# Altium project MASTER.PrjPcb
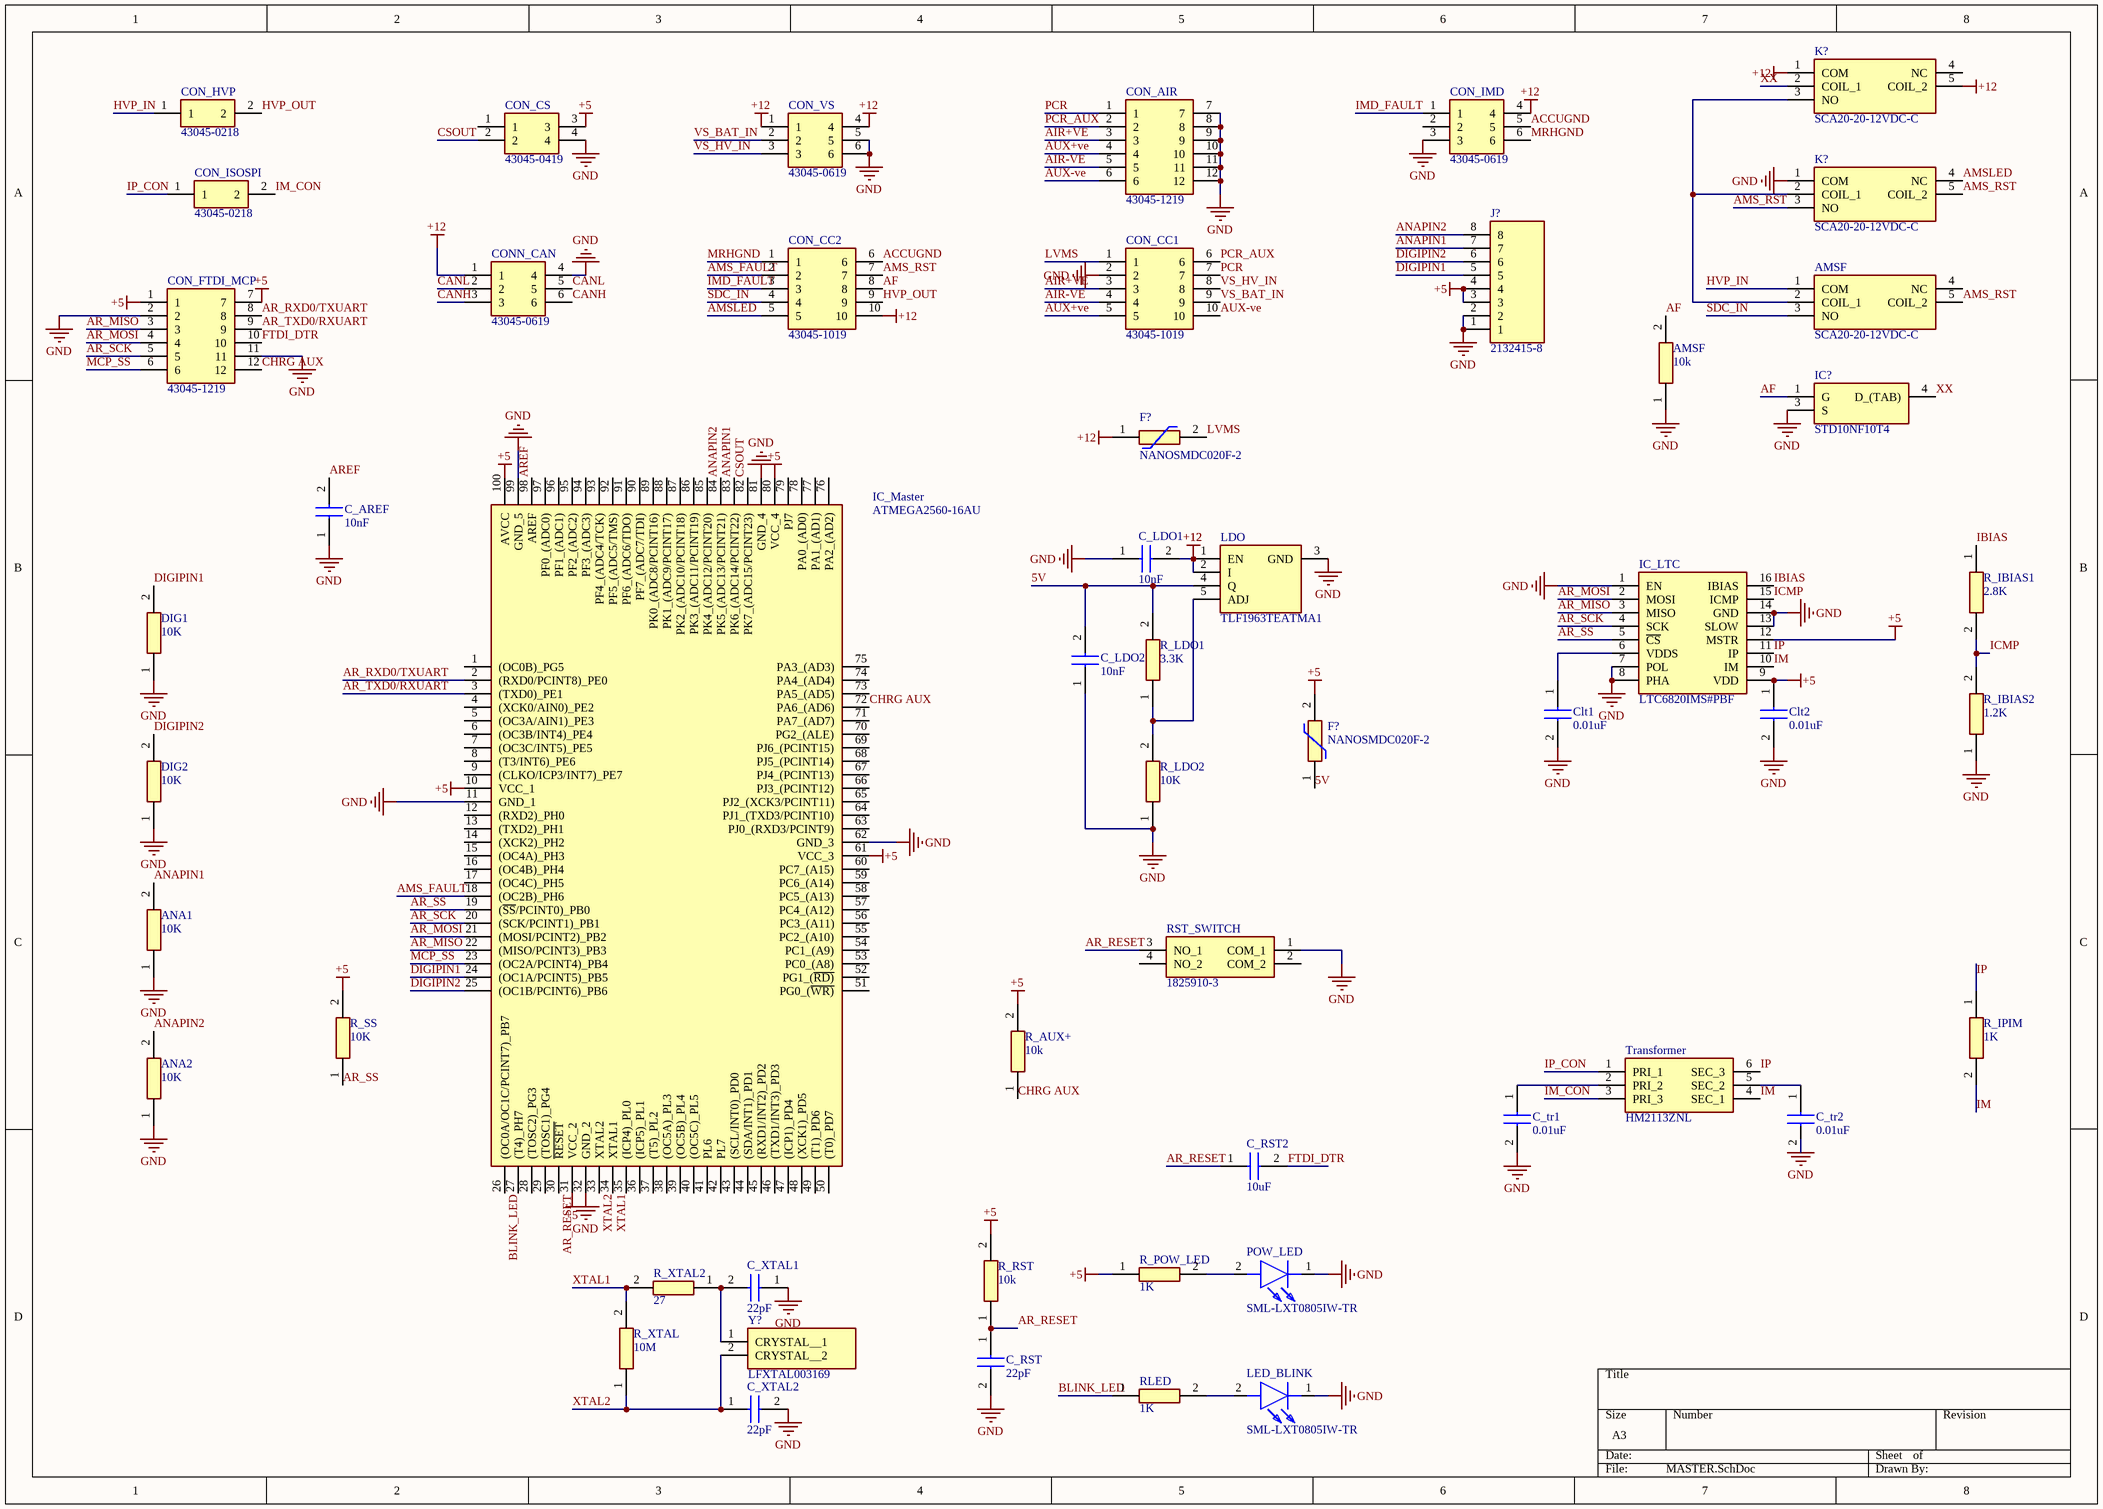
[diagram p0: MASTER.SchDoc]
1 sheet, 53 parts. Net scope: global (net labels, ports and power ports of the same name join across sheets).
Board file: MASTER.PcbDoc

## Sheet MASTER.SchDoc
size A3; SheetNumber: 1; SheetTotal: 1

### Parts
(Parts that share a designator on the sheet are numbered #1, #2 ... from top to bottom, then left to right.)
AMSF#1  SCA20-20-12VDC-C  [SCA202012VDCC]
AMSF#2  10k  [RESC2012X60N]
ANA1  10K  [RESC2012X60N]
ANA2  10K  [RESC2012X60N]
C_AREF  10nF  [C2012_Commercial]
C_LDO1  10nF  [C2012_Commercial]
C_LDO2  10nF  [C2012_Commercial]
C_RST  22pF  [C2012_Commercial]
C_RST2  10uF  [C2012_Commercial]
C_tr1  0.01uF  [C2012_Commercial]
C_tr2  0.01uF  [C2012_Commercial]
C_XTAL1  22pF  [C2012_Commercial]
C_XTAL2  22pF  [C2012_Commercial]
Clt1  0.01uF  [C2012_Commercial]
Clt2  0.01uF  [C2012_Commercial]
CON_AIR  43045-1219  [43045-12YY_181920]
CON_CC1  43045-1019  [43045-10YY_181920]
CON_CC2  43045-1019  [43045-10YY_181920]
CON_CS  43045-0419  [43045-04YY_181920]
CON_FTDI_MCP  43045-1219  [43045-12YY_181920]
CON_HVP  43045-0218  [43045-02YY_181920]
CON_IMD  43045-0619  [43045-06YY_181920]
CON_ISOSPI  43045-0218  [43045-02YY_181920]
CON_VS  43045-0619  [43045-06YY_181920]
CONN_CAN  43045-0619  [43045-06YY_181920]
DIG1  10K  [RESC2012X60N]
DIG2  10K  [RESC2012X60N]
F?#1  NANOSMDC020F-2  [NANOSMDC016F2]
F?#2  NANOSMDC020F-2  [NANOSMDC016F2]
IC?  STD10NF10T4  [TO228P972X240-3N]
IC_LTC  LTC6820IMS#PBF  [SOP50P490X110-16N]
IC_Master  ATMEGA2560-16AU  [QFP50P1600X1600X120-100N]
J?  2132415-8  [21324158]
K?#1  SCA20-20-12VDC-C  [SCA202012VDCC]
K?#2  SCA20-20-12VDC-C  [SCA202012VDCC]
LDO  TLF1963TEATMA1  [TLF1963TEATMA1]
LED_BLINK  SML-LXT0805IW-TR  [LEDC2012X80N]
POW_LED  SML-LXT0805IW-TR  [LEDC2012X80N]
R_AUX+  10k  [RESC2012X60N]
R_IBIAS1  2.8K  [RESC2012X60N]
R_IBIAS2  1.2K  [RESC2012X60N]
R_IPIM  1K  [RESC2012X60N]
R_LDO1  3.3K  [RESC2012X60N]
R_LDO2  10K  [RESC2012X60N]
R_POW_LED  1K  [RESC2012X60N]
R_RST  10k  [RESC2012X60N]
R_SS  10K  [RESC2012X60N]
R_XTAL  10M  [RESC2012X60N]
R_XTAL2  27  [RESC2012X60N]
RLED  1K  [RESC2012X60N]
RST_SWITCH  1825910-3  [18259103]
Transformer  HM2113ZNL  [HM2113ZNL]
Y?  LFXTAL003169  [LFXTAL003169]

### Nets
+5: Clt2.1 CON_CS.3 CON_FTDI_MCP.1 CON_FTDI_MCP.7 F?#2.2 IC_LTC.9(VDD) IC_LTC.12(MSTR) IC_Master.10(VCC_1) IC_Master.31(VCC_2) IC_Master.61(VCC_3) IC_Master.80(VCC_4) IC_Master.100(AVCC) J?.3 J?.4 R_AUX+.2 R_POW_LED.1 R_RST.2 R_SS.2
+12: C_LDO1.2 CON_CC2.10 CON_IMD.4 CON_VS.1 CON_VS.4 CONN_CAN.1 F?#1.1 K?#1.1(COM) K?#1.5(COIL_2) LDO.1(EN) LDO.2(I)
GND: AMSF#2.1 ANA1.1 ANA2.1 C_AREF.1 C_LDO1.1 C_LDO2.1 C_RST.2 C_tr1.2 C_tr2.2 C_XTAL1.1 C_XTAL2.2 Clt1.2 Clt2.2 CON_AIR.7 CON_AIR.8 CON_AIR.9 CON_AIR.10 CON_AIR.11 CON_AIR.12 CON_CC1.2 CON_CS.4 CON_FTDI_MCP.2 CON_FTDI_MCP.11 CON_IMD.3 CON_VS.5 CON_VS.6 CONN_CAN.4 DIG1.1 DIG2.1 IC?.3(S) IC_LTC.1(EN) IC_LTC.7(POL) IC_LTC.8(PHA) IC_LTC.13(SLOW) IC_LTC.14(GND) IC_Master.11(GND_1) IC_Master.32(GND_2) IC_Master.62(GND_3) IC_Master.81(GND_4) IC_Master.99(GND_5) J?.1 J?.2 K?#2.1(COM) LDO.3(GND) LED_BLINK.1(K) POW_LED.1(K) R_IBIAS2.1 R_LDO2.1 RST_SWITCH.1(COM_1)
5V: C_LDO2.2 F?#2.1 LDO.4(Q) R_LDO1.2
ACCUGND: CON_CC2.6 CON_IMD.5
AF: AMSF#2.2 CON_CC2.8 IC?.1(G)
AIR+VE: CON_AIR.3 CON_CC1.3
AIR-VE: CON_AIR.5 CON_CC1.4
AMS_FAULT: CON_CC2.2 IC_Master.18((OC2B)_PH6)
AMS_RST: AMSF#1.5(COIL_2) CON_CC2.7 K?#2.3(NO) K?#2.5(COIL_2)
AMSLED: CON_CC2.5 K?#2.4(NC)
ANAPIN1: ANA1.2 IC_Master.83(PK6_(ADC14/PCINT22)) J?.7
ANAPIN2: ANA2.2 IC_Master.84(PK5_(ADC13/PCINT21)) J?.8
AR_MISO: CON_FTDI_MCP.3 IC_LTC.3(MISO) IC_Master.22((MISO/PCINT3)_PB3)
AR_MOSI: CON_FTDI_MCP.4 IC_LTC.2(MOSI) IC_Master.21((MOSI/PCINT2)_PB2)
AR_RESET: C_RST.1 C_RST2.1 IC_Master.30(~{RESET}) R_RST.1 RST_SWITCH.3(NO_1)
AR_RXD0/TXUART: CON_FTDI_MCP.8 IC_Master.2((RXD0/PCINT8)_PE0)
AR_SCK: CON_FTDI_MCP.5 IC_LTC.4(SCK) IC_Master.20((SCK/PCINT1)_PB1)
AR_SS: IC_LTC.5(~{CS}) IC_Master.19((~{SS}/PCINT0)_PB0) R_SS.1
AR_TXD0/RXUART: CON_FTDI_MCP.9 IC_Master.3((TXD0)_PE1)
AREF: C_AREF.2 IC_Master.98(AREF)
AUX+ve: CON_AIR.4 CON_CC1.5
AUX-ve: CON_AIR.6 CON_CC1.10
BLINK_LED: IC_Master.26((OC0A/OC1C/PCINT7)_PB7) RLED.1
CANH: CONN_CAN.3 CONN_CAN.6
CANL: CONN_CAN.2 CONN_CAN.5
CHRG AUX: CON_FTDI_MCP.12 IC_Master.72(PA6_(AD6)) R_AUX+.1
CSOUT: CON_CS.2 IC_Master.82(PK7_(ADC15/PCINT23))
DIGIPIN1: DIG1.2 IC_Master.24((OC1A/PCINT5)_PB5) J?.5
DIGIPIN2: DIG2.2 IC_Master.25((OC1B/PCINT6)_PB6) J?.6
FTDI_DTR: C_RST2.2 CON_FTDI_MCP.10
HVP_IN: AMSF#1.1(COM) CON_HVP.1
HVP_OUT: CON_CC2.9 CON_HVP.2
IBIAS: IC_LTC.16(IBIAS) R_IBIAS1.1
ICMP: IC_LTC.15(ICMP) R_IBIAS1.2 R_IBIAS2.2
IM: IC_LTC.10(IM) R_IPIM.2 Transformer.4(SEC_1)
IM_CON: CON_ISOSPI.2 Transformer.3(PRI_3)
IMD_FAULT: CON_CC2.3 CON_IMD.1
IP: IC_LTC.11(IP) R_IPIM.1 Transformer.6(SEC_3)
IP_CON: CON_ISOSPI.1 Transformer.1(PRI_1)
LVMS: CON_CC1.1 F?#1.2
MCP_SS: CON_FTDI_MCP.6 IC_Master.23((OC2A/PCINT4)_PB4)
MRHGND: CON_CC2.1 CON_IMD.6
PCR: CON_AIR.1 CON_CC1.7
PCR_AUX: CON_AIR.2 CON_CC1.6
SDC_IN: AMSF#1.3(NO) CON_CC2.4
VS_BAT_IN: CON_CC1.9 CON_VS.2
VS_HV_IN: CON_CC1.8 CON_VS.3
XTAL1: IC_Master.34(XTAL1) R_XTAL.2 R_XTAL2.2
XTAL2: C_XTAL2.1 IC_Master.33(XTAL2) R_XTAL.1 Y?.2(CRYSTAL__2)
XX: IC?.4(D_(TAB)) K?#1.2(COIL_1)
NetAMSF#1_2: AMSF#1.2(COIL_1) K?#1.3(NO) K?#2.2(COIL_1)
NetC_tr1_1: C_tr1.1 Transformer.2(PRI_2)
NetC_tr2_1: C_tr2.1 Transformer.5(SEC_2)
NetC_XTAL1_2: C_XTAL1.2 R_XTAL2.1 Y?.1(CRYSTAL__1)
NetClt1_1: Clt1.1 IC_LTC.6(VDDS)
NetLDO_5: LDO.5(ADJ) R_LDO1.1 R_LDO2.2
NetLED_BLINK_2: LED_BLINK.2(A) RLED.2
NetPOW_LED_2: POW_LED.2(A) R_POW_LED.2

Not connected (* = marked no-connect by the designer): AMSF#1 4(NC); CON_CS 1; CON_IMD 2; IC_Master 1((OC0B)_PG5) 4((XCK0/AIN0)_PE2) 5((OC3A/AIN1)_PE3) 6((OC3B/INT4)_PE4) 7((OC3C/INT5)_PE5) 8((T3/INT6)_PE6) 9((CLKO/ICP3/INT7)_PE7) 12((RXD2)_PH0) 13((TXD2)_PH1) 14((XCK2)_PH2) 15((OC4A)_PH3) 16((OC4B)_PH4) 17((OC4C)_PH5) 27((T4)_PH7) 28((TOSC2)_PG3) 29((TOSC1)_PG4) 35((ICP4)_PL0) 36((ICP5)_PL1) 37((T5)_PL2) 38((OC5A)_PL3) 39((OC5B)_PL4) 40((OC5C)_PL5) 41(PL6) 42(PL7) 43((SCL/INT0)_PD0) 44((SDA/INT1)_PD1) 45((RXD1/INT2)_PD2) 46((TXD1/INT3)_PD3) 47((ICP1)_PD4) 48((XCK1)_PD5) 49((T1)_PD6) 50((T0)_PD7) 51(PG0_(~{WR)}) 52(PG1_(~{RD)}) 53(PC0_(A8)) 54(PC1_(A9)) 55(PC2_(A10)) 56(PC3_(A11)) 57(PC4_(A12)) 58(PC5_(A13)) 59(PC6_(A14)) 60(PC7_(A15)) 63(PJ0_(RXD3/PCINT9)) 64(PJ1_(TXD3/PCINT10)) 65(PJ2_(XCK3/PCINT11)) 66(PJ3_(PCINT12)) 67(PJ4_(PCINT13)) 68(PJ5_(PCINT14)) 69(PJ6_(PCINT15)) 70(PG2_(ALE)) 71(PA7_(AD7)) 73(PA5_(AD5)) 74(PA4_(AD4)) 75(PA3_(AD3)) 76(PA2_(AD2)) 77(PA1_(AD1)) 78(PA0_(AD0)) 79(PJ7) 85(PK4_(ADC12/PCINT20)) 86(PK3_(ADC11/PCINT19)) 87(PK2_(ADC10/PCINT18)) 88(PK1_(ADC9/PCINT17)) 89(PK0_(ADC8/PCINT16)) 90(PF7_(ADC7/TDI)) 91(PF6_(ADC6/TDO)) 92(PF5_(ADC5/TMS)) 93(PF4_(ADC4/TCK)) 94(PF3_(ADC3)) 95(PF2_(ADC2)) 96(PF1_(ADC1)) 97(PF0_(ADC0)); K?#1 4(NC); RST_SWITCH 2(COM_2) 4(NO_2)

### Library data of the parts
AMSF#1 K?#1 K?#2 = SCA20-20-12VDC-C: Relay or Contactor; Manufacturer_Name: LEONE; Datasheet Link: https://www.kuraelectronics.com/new-pdf/SCA%2020.pdf; Height: 13.7mm; Manufacturer_Part_Number: SCA20-20-12VDC-C
AMSF#2 R_AUX+ R_IBIAS1 R_IBIAS2 R_IPIM R_LDO1 R_LDO2 R_POW_LED R_RST R_SS R_XTAL R_XTAL2 RLED = RC0805JR-0710KL: Resistor; Manufacturer_Name: KEMET; Height: 0.6mm; Manufacturer_Part_Number: RC0805JR-0710KL; Mouser Part Number: 603-RC0805JR-0710KL; Mouser Price/Stock: https://www.mouser.co.uk/ProductDetail/YAGEO/RC0805JR-0710KL?qs=ZFGQJeMQzF5q%2Fp77vM%2FrVQ%3D%3D; Arrow Part Number: RC0805JR-0710KL; Arrow Price/Stock: https://www.arrow.com/en/products/rc0805jr-0710kl/yageo
  AMSF#2 R_SS: Datasheet Link: http://www.yageo.com/documents/recent/PYu-RC_Group_51_RoHS_L_10.pdf
  R_AUX+ R_IBIAS1 R_IBIAS2 R_IPIM R_LDO1 R_LDO2 R_POW_LED R_RST R_XTAL R_XTAL2 RLED: Datasheet Link: https://datasheet.datasheetarchive.com/originals/distributors/Datasheets_SAMA/902f9e387b938f871d31120f5fc1d65e.pdf
ANA1 ANA2 DIG1 DIG2 = RC0805JR-0710KL: Resistor; Manufacturer_Name: YAGEO; Datasheet Link: https://componentsearchengine.com/Datasheets/2/RC0805JR-0710KL.pdf; Height: 0.6mm; Manufacturer_Part_Number: RC0805JR-0710KL; Mouser Part Number: 603-RC0805JR-0710KL; Mouser Price/Stock: https://www.mouser.co.uk/ProductDetail/YAGEO/RC0805JR-0710KL?qs=ZFGQJeMQzF5q%2Fp77vM%2FrVQ%3D%3D; Arrow Part Number: RC0805JR-0710KL; Arrow Price/Stock: https://www.arrow.com/en/products/rc0805jr-0710kl/yageo?region=nac
C_AREF C_LDO1 C_LDO2 C_RST C_RST2 C_tr1 C_tr2 C_XTAL1 C_XTAL2 Clt1 Clt2 = C2012C0G1E333J125AA: Capacitor; Manufacturer_Name: TDK; Datasheet Link: https://product.tdk.com/system/files/dam/doc/product/capacitor/ceramic/mlcc/catalog/mlcc_commercial_general_en.pdf; Height: 0.75mm; Manufacturer_Part_Number: C2012C0G1E333J125AA; Mouser Part Number: 810-C2012C0G1E333J; Mouser Price/Stock: https://www.mouser.co.uk/ProductDetail/TDK/C2012C0G1E333J125AA?qs=NRhsANhppD9YN6415mAquQ%3D%3D; Arrow Part Number: C2012C0G1E333J125AA; Arrow Price/Stock: https://www.arrow.com/en/products/c2012c0g1e333j125aa/tdk
CON_AIR CON_FTDI_MCP = 43045-1219: Connector; Manufacturer_Name: Molex; Datasheet Link: https://www.molex.com/pdm_docs/sd/430450218_sd.pdf; Height: 9.91mm; Manufacturer_Part_Number: 43045-1219; Mouser Part Number: 538-43045-1219; Mouser Price/Stock: https://www.mouser.co.uk/ProductDetail/Molex/43045-1219?qs=359VwiUTsp3iCU2NVYxNVg%3D%3D
CON_CC1 CON_CC2 = 43045-1019: Connector; Manufacturer_Name: Molex; Datasheet Link: https://www.molex.com/pdm_docs/sd/430450218_sd.pdf; Height: 9.91mm; Manufacturer_Part_Number: 43045-1019; Mouser Part Number: 538-43045-1019; Mouser Price/Stock: https://www.mouser.co.uk/ProductDetail/Molex/43045-1019?qs=OWQJ9aScCGICje0BO%252BCnwQ%3D%3D; Arrow Part Number: 43045-1019; Arrow Price/Stock: https://www.arrow.com/en/products/43045-1019/molex?region=nac
CON_CS = 43045-0419: Connector; Manufacturer_Name: Molex; Datasheet Link: https://www.molex.com/pdm_docs/sd/430450218_sd.pdf; Height: 9.91mm; Manufacturer_Part_Number: 43045-0419; Mouser Part Number: 538-43045-0419; Mouser Price/Stock: https://www.mouser.co.uk/ProductDetail/Molex/43045-0419?qs=UeCeOHRHQebVNIQyI9VWWg%3D%3D
CON_HVP CON_ISOSPI = 43045-0218: Connector; Manufacturer_Name: Molex; Datasheet Link: https://www.molex.com/pdm_docs/sd/430450218_sd.pdf; Height: 9.91mm; Manufacturer_Part_Number: 43045-0218; Mouser Part Number: 538-43045-0218; Mouser Price/Stock: https://www.mouser.co.uk/ProductDetail/Molex/43045-0218?qs=4XSMV6Twtb2qUKINalLbdA%3D%3D; Arrow Part Number: 43045-0218; Arrow Price/Stock: https://www.arrow.com/en/products/43045-0218/molex
CON_IMD CON_VS CONN_CAN = 43045-0619: Connector; Manufacturer_Name: Molex; Datasheet Link: https://www.molex.com/pdm_docs/sd/430450218_sd.pdf; Height: 9.91mm; Manufacturer_Part_Number: 43045-0619; Mouser Part Number: 538-43045-0619; Mouser Price/Stock: https://www.mouser.co.uk/ProductDetail/Molex/43045-0619?qs=KC2ywxza1kr7EVu5MuTw7g%3D%3D; Arrow Part Number: 43045-0619; Arrow Price/Stock: https://www.arrow.com/en/products/43045-0619/molex
F?#1 F?#2 = NANOSMDC020F-2: Resettable Fuse; Manufacturer_Name: LITTELFUSE; Datasheet Link: https://www.littelfuse.com/~/media/electronics/datasheets/resettable_ptcs/littelfuse_ptc_nanosmdc_datasheet.pdf.pdf; Height: 1mm; Manufacturer_Part_Number: NANOSMDC020F-2; Mouser Part Number: 650-NANOSMDC020F-2; Mouser Price/Stock: https://www.mouser.co.uk/ProductDetail/Littelfuse/NANOSMDC020F-2?qs=iK0evp%252BCRRU6agwMt7HYjg%3D%3D; Arrow Part Number: NANOSMDC020F-2; Arrow Price/Stock: https://www.arrow.com/en/products/nanosmdc020f-2/littelfuse
IC? = STD10NF10T4: Integrated Circuit; Manufacturer_Name: STMicroelectronics; Datasheet Link: http://www.st.com/web/en/resource/technical/document/datasheet/CD00002133.pdf; Height: 2.4mm; Manufacturer_Part_Number: STD10NF10T4; Mouser Part Number: 511-STD10NF10; Mouser Price/Stock: https://www.mouser.co.uk/ProductDetail/STMicroelectronics/STD10NF10T4?qs=El1T93pd01%2FBh%252BX9NfIsIQ%3D%3D; Arrow Part Number: STD10NF10T4; Arrow Price/Stock: https://www.arrow.com/en/products/std10nf10t4/stmicroelectronics
IC_LTC = LTC6820IMS#PBF: Integrated Circuit; Manufacturer_Name: Analog Devices; Datasheet Link: https://datasheet.datasheetarchive.com/originals/distributors/Datasheets-SFU1/DSASFU10008504.pdf; Height: 1.1mm; Manufacturer_Part_Number: LTC6820IMS#PBF; Mouser Part Number: 584-LTC6820IMS#PBF; Mouser Price/Stock: https://www.mouser.co.uk/ProductDetail/Analog-Devices/LTC6820IMSPBF?qs=hVkxg5c3xu9mQWZApkXW1Q%3D%3D; Arrow Part Number: LTC6820IMS#PBF; Arrow Price/Stock: https://www.arrow.com/en/products/ltc6820imspbf/linear-technology
IC_Master = ATMEGA2560-16AU: Integrated Circuit; Manufacturer_Name: Microchip; Datasheet Link: https://datasheet.datasheetarchive.com/originals/distributors/Datasheets_SAMA/4a5a397fa76c39b5297f4121ace1d84e.pdf; Height: 1.2mm; Manufacturer_Part_Number: ATMEGA2560-16AU; Mouser Part Number: 556-ATMEGA2560-16AU; Mouser Price/Stock: https://www.mouser.co.uk/ProductDetail/Microchip-Technology-Atmel/ATMEGA2560-16AU?qs=aqrrBurbvGciYmlAokFS0w%3D%3D; Arrow Part Number: ATMEGA2560-16AU; Arrow Price/Stock: https://www.arrow.com/en/products/atmega2560-16au/microchip-technology?region=nac
J? = 2132415-8: Connector; Manufacturer_Name: TE Connectivity; Datasheet Link: https://componentsearchengine.com/Datasheets/2/2132415-8.pdf; Height: 8.93mm; Manufacturer_Part_Number: 2132415-8; Mouser Part Number: 571-2132415-8; Mouser Price/Stock: https://www.mouser.co.uk/ProductDetail/TE-Connectivity/2132415-8?qs=XhI5AayaxxU5%2FK%252BXTeVEJQ%3D%3D; Arrow Part Number: 2132415-8; Arrow Price/Stock: https://www.arrow.com/en/products/2132415-8/te-connectivity?region=nac
LDO = TLF1963TEATMA1: Integrated Circuit; Manufacturer_Name: Infineon; Datasheet Link: https://www.infineon.com/dgdl/Infineon-TLF1963-DS-v01_00-EN.pdf?fileId=5546d46258fc0bc1015969d2981941e0; Height: 2.35mm; Manufacturer_Part_Number: TLF1963TEATMA1; Mouser Part Number: 726-TLF1963TEATMA1; Mouser Price/Stock: https://www.mouser.co.uk/ProductDetail/Infineon-Technologies/TLF1963TEATMA1?qs=SiyfpgnvCZluIGE%2FbZiglw%3D%3D; Arrow Part Number: TLF1963TEATMA1; Arrow Price/Stock: https://www.arrow.com/en/products/tlf1963teatma1/infineon-technologies-ag?region=nac
LED_BLINK POW_LED = SML-LXT0805IW-TR: LED; Manufacturer_Name: Lumex; Datasheet Link: http://uk.rs-online.com/web/p/products/8886313; Height: 0.8mm; Manufacturer_Part_Number: SML-LXT0805IW-TR; Mouser Part Number: 696-SML-LXT0805IW; Mouser Price/Stock: https://www.mouser.co.uk/ProductDetail/Lumex/SML-LXT0805IW-TR?qs=9HInCHf8eFgASaxWaq368w%3D%3D; Arrow Part Number: SML-LXT0805IW-TR; Arrow Price/Stock: https://www.arrow.com/en/products/sml-lxt0805iw-tr/lumex
RST_SWITCH = 1825910-3: Switch; Manufacturer_Name: TE Connectivity; Datasheet Link: http://uk.rs-online.com/web/p/products/4791407; Height: 4.3mm; Manufacturer_Part_Number: 1825910-3; Mouser Part Number: N/A; Mouser Price/Stock: https://www.mouser.co.uk/ProductDetail/TE-Connectivity/1825910-3?qs=bdENzIhz2rnPyBgKfIxERA%3D%3D; Arrow Part Number: 1825910-3; Arrow Price/Stock: https://www.arrow.com/en/products/1825910-3/te-connectivity?region=nac
Transformer = HM2113ZNL: Transformer; Manufacturer_Name: Pulse; Datasheet Link: https://www.mouser.com/datasheet/2/336/HM2113ZNL-1224943.pdf; Height: 3.45mm; Manufacturer_Part_Number: HM2113ZNL; Mouser Part Number: 673-HM2113ZNL; Mouser Price/Stock: https://www.mouser.co.uk/ProductDetail/Pulse-Electronics/HM2113ZNL?qs=chTDxNqvsykAwD5fAZXknQ%3D%3D; Arrow Part Number: HM2113ZNL; Arrow Price/Stock: https://www.arrow.com/en/products/hm2113znl/pulse-electronics-corporation?region=nac
Y? = LFXTAL003169: Crystal or Oscillator; Manufacturer_Name: IQD; Datasheet Link: https://componentsearchengine.com/Datasheets/2/LFXTAL003169.pdf; Height: 4.1mm; Manufacturer_Part_Number: LFXTAL003169